# Altium schematic sheet SecuritySchematic.SchDoc
size A
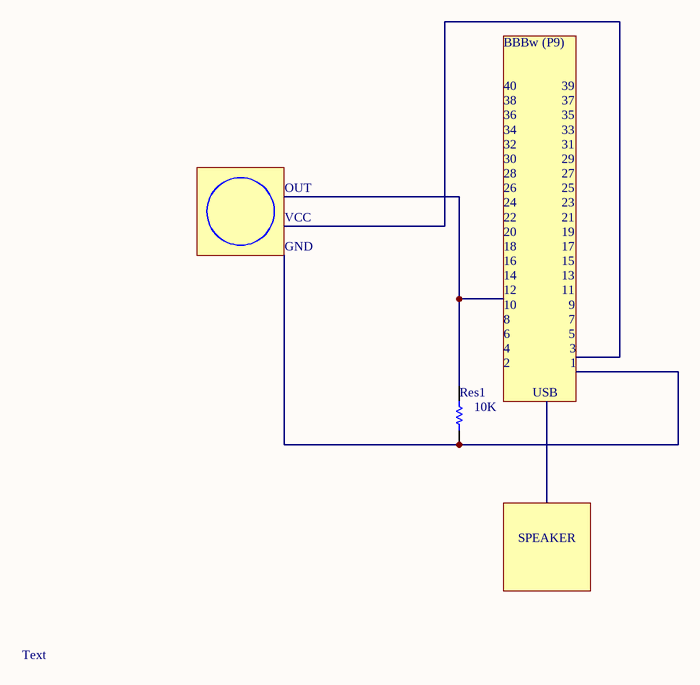
[diagram p0: SecuritySchematic.SchDoc]

## Parts
?  Res1  value 10K  [AXIAL-0.3]

## Nets

Not connected (* = marked no-connect by the designer): ? 1 2

## Notes on the sheet
- BBBw (P9)
- 32
- 34
- 36
- 38
- 40
- 39
- 37
- 35
- 33
- 31
- VCC
- OUT
- 22
- 24
- 26
- 28
- 30
- 29
- 27
- 25
- 23
- 21
- GND
- 12
- 14
- 16
- 18
- 20
- 19
- 17
- 15
- 13
- 11
- 2
- 4
- 6
- 8
- 10
- 9
- 7
- 5
- 3
- 1
- USB
- SPEAKER
- Text

## Library data of the parts
? = Res1: Resistor; Published: 8-Jun-2000; LatestRevisionDate: 17-Jul-2002; LatestRevisionNote: Re-released for DXP Platform.; PackageReference: AXIAL-0.3; Publisher: Altium Limited; PackageDescription: Axial Device, Thru-Hole; 2 Leads; 0.3 in Pin Spacing